# EAGLE design divider-top (EAGLE 7.7.0)
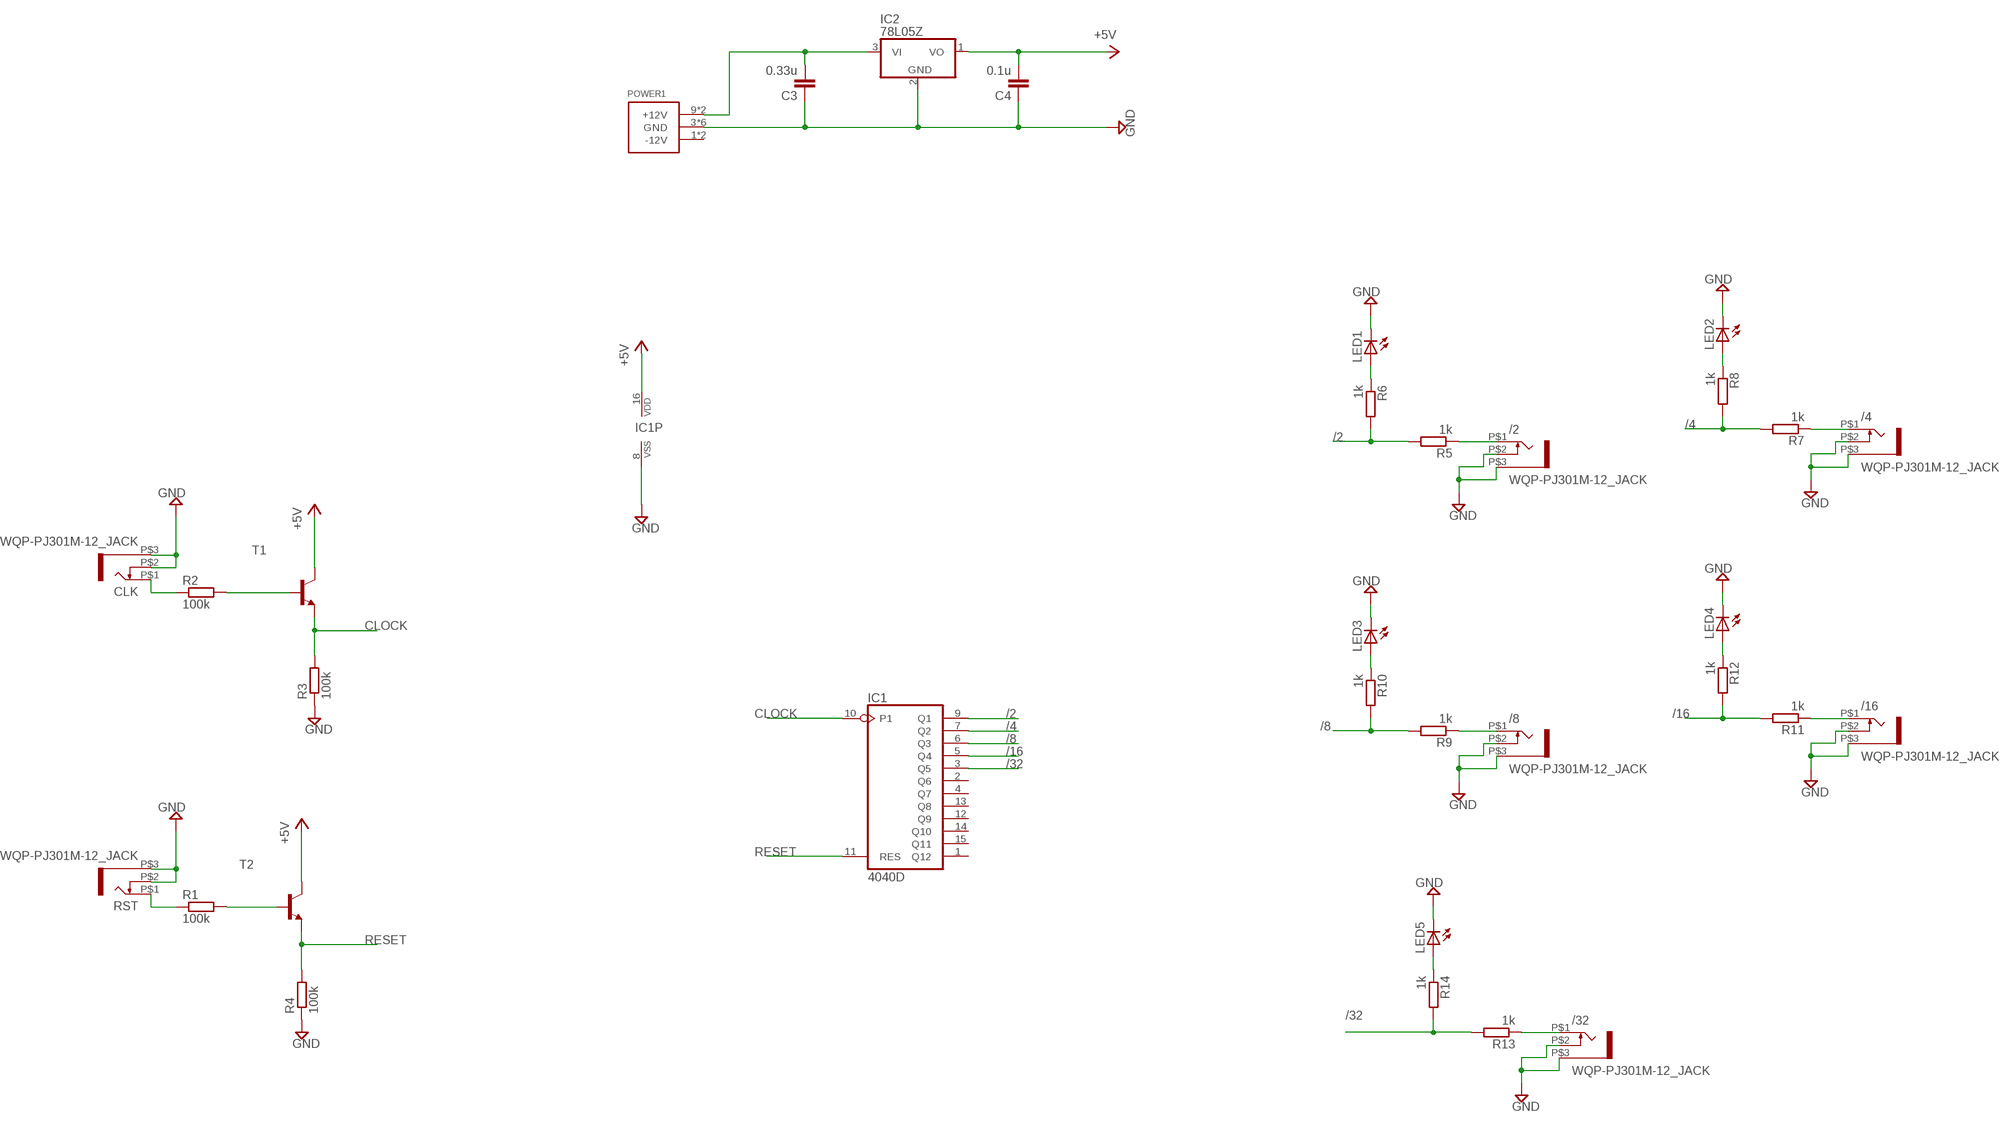
[diagram p0: schematic, sheet 1]

## Parts
/2  WQP-PJ301M-12_JACK  [WQP-PJ301M-12_JACK]
/4  WQP-PJ301M-12_JACK  [WQP-PJ301M-12_JACK]
/8  WQP-PJ301M-12_JACK  [WQP-PJ301M-12_JACK]
/16  WQP-PJ301M-12_JACK  [WQP-PJ301M-12_JACK]
/32  WQP-PJ301M-12_JACK  [WQP-PJ301M-12_JACK]
C3  0.33u  C-EUC0805  [C0805]
C4  0.1u  C-EUC0805  [C0805]
CLK  WQP-PJ301M-12_JACK  [WQP-PJ301M-12_JACK]
IC1  4040D  [SO16]
IC2  78L05Z  [TO92]
LED1  LEDCHIP-LED0805  [CHIP-LED0805]
LED2  LEDCHIP-LED0805  [CHIP-LED0805]
LED3  LEDCHIP-LED0805  [CHIP-LED0805]
LED4  LEDCHIP-LED0805  [CHIP-LED0805]
LED5  LEDCHIP-LED0805  [CHIP-LED0805]
POWER1  POWER_SIMPLE10  [POWER_10]
R1  100k  R-EU_R0805  [R0805]
R2  100k  R-EU_R0805  [R0805]
R3  100k  R-EU_R0805  [R0805]
R4  100k  R-EU_R0805  [R0805]
R5  1k  R-EU_R0805  [R0805]
R6  1k  R-EU_R0805  [R0805]
R7  1k  R-EU_R0805  [R0805]
R8  1k  R-EU_R0805  [R0805]
R9  1k  R-EU_R0805  [R0805]
R10  1k  R-EU_R0805  [R0805]
R11  1k  R-EU_R0805  [R0805]
R12  1k  R-EU_R0805  [R0805]
R13  1k  R-EU_R0805  [R0805]
R14  1k  R-EU_R0805  [R0805]
RST  WQP-PJ301M-12_JACK  [WQP-PJ301M-12_JACK]
T1  MMBT3904LT1-NPN-SOT23-BEC  [SOT23-BEC]
T2  MMBT3904LT1-NPN-SOT23-BEC  [SOT23-BEC]

## Nets
+5V: C4.2 IC1.16(VDD) IC2.1(VO) T1.C T2.C
/2: IC1.9(Q1) R5.2 R6.2
/4: IC1.7(Q2) R7.2 R8.2
/8: IC1.6(Q3) R9.2 R10.2
/16: IC1.5(Q4) R11.2 R12.2
/32: IC1.3(Q5) R13.2 R14.2
CLOCK: IC1.10(P1) R3.2 T1.E
GND: /2.P$2 /2.P$3 /4.P$2 /4.P$3 /8.P$2 /8.P$3 /16.P$2 /16.P$3 /32.P$2 /32.P$3 C3.1 C4.1 CLK.P$2 CLK.P$3 IC1.8(VSS) IC2.2(GND) LED1.C LED2.C LED3.C LED4.C LED5.C POWER1.3(GND) POWER1.4(GND) POWER1.5(GND) POWER1.6(GND) POWER1.7(GND) POWER1.8(GND) R3.1 R4.1 RST.P$2 RST.P$3
N$1: R1.1 RST.P$1
N$2: R1.2 T2.B
N$3: CLK.P$1 R2.1
N$4: /2.P$1 R5.1
N$5: R2.2 T1.B
N$6: /32.P$1 R13.1
N$7: LED1.A R6.1
N$8: LED5.A R14.1
N$9: /4.P$1 R7.1
N$10: LED2.A R8.1
N$12: /8.P$1 R9.1
N$13: LED3.A R10.1
N$15: /16.P$1 R11.1
N$16: LED4.A R12.1
N$21: C3.2 IC2.3(VI) POWER1.9(+12V) POWER1.10(+12V)
RESET: IC1.11(RES) R4.2 T2.E
Unconnected: IC1.1(Q12) IC1.2(Q6) IC1.4(Q7) IC1.12(Q9) IC1.13(Q8) IC1.14(Q10) IC1.15(Q11) POWER1.1(-12V) POWER1.2(-12V)

## Library data of the parts
/2 /4 /8 /16 /32 CLK RST = thonkiconn:WQP-PJ301M-12_JACK
C3 C4 = rcl:C-EU: CAPACITOR, European symbol
IC1 = 40xx:4040: 12-stage binary/ripple COUNTER
IC2 = linear:78*: Positive VOLTAGE REGULATOR Source: http://cache.national.com/ds/LM/LM78L05.pdf http://www.fairchildsemi.com/ds/LM/LM7805.pdf
LED1-LED5 = led:LED: LED OSRAM: - CHIPLED LG R971, LG N971, LY N971, LG Q971, LY Q971, LO R971, LY R971 LH N974, LH R974 LS Q976, LO Q976, LY Q976 LO Q996 - Hyper CHIPLED LW Q18S LB Q993, LB Q99A, LB R99A - SideLED LS A670, LO A670, LY A670, LG A670, LP A670 LB A673, LV A673, LT A673, LW A673 LH A674 LY A675 LS A676, LA A676, LO A676, LY A676, LW A676 LS A679, LY A679, LG A679 - Hyper Micro SIDELED® LS Y876, LA Y876, LO Y876, LY Y876 LT Y87S - SmartLED LW L88C, LW L88S LB L89C, LB L89S, LG L890 LS L89K, LO L89K, LY L89K LS L896, LA L896, LO L896, LY L896 - TOPLED LS T670, LO T670, LY T670, LG T670, LP T670 LSG T670, LSP T670, LSY T670, LOP T670, LYG T670 LG T671, LOG T671, LSG T671 LB T673, LV T673, LT T673, LW T673 LH T674 LS T676, LA T676, LO T676, LY T676, LB T676, LH T676, LSB T676, LW T676 LB T67C, LV T67C, LT T67C, LS T67K, LO T67K, LY T67K, LW E67C LS E67B, LA E67B, LO E67B, LY E67B, LB E67C, LV E67C, LT E67C LW T67C LS T679, LY T679, LG T679 LS T770, LO T770, LY T770, LG T770, LP T770 LB T773, LV T773, LT T773, LW T773 LH T774 LS E675, LA E675, LY E675, LS T675 LS T776, LA T776, LO T776, LY T776, LB T776 LHGB T686 LT T68C, LB T68C - Hyper Mini TOPLED® LB M676 - Mini TOPLED Santana® LG M470 LS M47K, LO M47K, LY M47K Source: http://www.osram.convergy.de LUXEON: - LUMILED® LXK2-PW12-R00, LXK2-PW12-S00, LXK2-PW14-U00, LXK2-PW14-V00 LXK2-PM12-R00, LXK2-PM12-S00, LXK2-PM14-U00 LXK2-PE12-Q00, LXK2-PE12-R00, LXK2-PE12-S00, LXK2-PE14-T00, LXK2-PE14-U00 LXK2-PB12-K00, LXK2-PB12-L00, LXK2-PB12-M00, LXK2-PB14-N00, LXK2-PB14-P00, LXK2-PB14-Q00 LXK2-PR12-L00, LXK2-PR12-M00, LXK2-PR14-Q00, LXK2-PR14-R00 LXK2-PD12-Q00, LXK2-PD12-R00, LXK2-PD12-S00 LXK2-PH12-R00, LXK2-PH12-S00 LXK2-PL12-P00, LXK2-PL12-Q00, LXK2-PL12-R00 Source: www.luxeon.com KINGBRIGHT: KA-3528ASYC Source: www.kingbright.com
POWER1 = eurorack:POWER_SIMPLE
R1-R14 = rcl:R-EU_: RESISTOR, European symbol
T1 T2 = transistor:*-NPN-: NPN Transistror BF959 corrected 2008.03.06

## Board
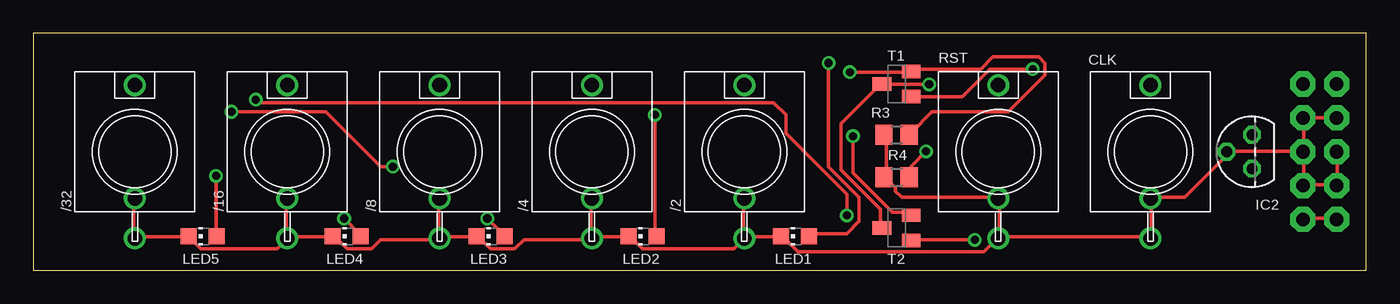
[diagram p1: board, top side]
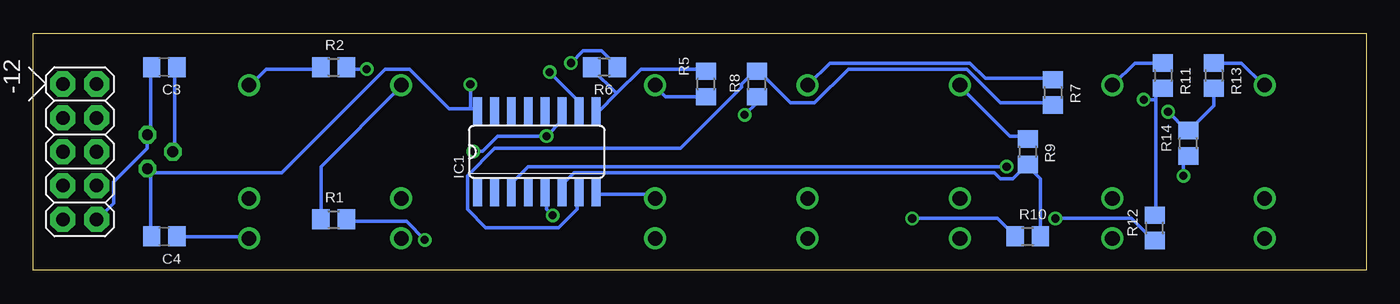
[diagram p2: board, bottom side, seen from below]

Size 100 x 17.77 mm. Coordinates in mm from the lower left corner, seen from the top.
Outline: 0,0 100,0 100,17.77 0,17.77 0,0
Copper layers (1*16): Top 0.035mm / dielectric 1.5mm / Bottom 0.035mm
Design rules "default": minimum track width 10mil, minimum drill 24mil, track to track 8mil, track to pad 8mil, pad to pad 8mil, via to via 8mil, smd to smd 8mil, copper to edge 40mil, drill to drill 8mil, minimum pad ring 10mil, minimum via ring 8mil, stop-mask expansion 4mil, vias tented up to drill 0mil, thermal gap 10mil

### Footprints (pad centres in the part's own frame; a part is rotated, then mirrored left to right if it is on the bottom)
WQP-PJ301M-12_JACK = drill 1.1: P$1 0,5; P$2 0,-3.5; P$3 0,-6.5
C0805 = smd 1.3 x 1.5: 1 -0.95,0; 2 0.95,0
SO16 = smd 0.66 x 2.032: 1 -4.445,-3.073; 2 -3.175,-3.073; 3 -1.905,-3.073; 4 -0.635,-3.073; 5 0.635,-3.073; 6 1.905,-3.073; 7 3.175,-3.073; 8 4.445,-3.073; 9 4.445,3.073; 10 3.175,3.073; 11 1.905,3.073; 12 0.635,3.073; 13 -0.635,3.073; 14 -1.905,3.073; 15 -3.175,3.073; 16 -4.445,3.073
TO92 = drill 0.813 octagon: 1 -1.27,0; 2 0,1.905; 3 1.27,0
CHIP-LED0805 = smd 1.2 x 1.2: A 0,-1.05; C 0,1.05
POWER_10 = drill 1.016 pad 1.88 octagon: 1 -5.08,-1.27; 2 -5.08,1.27; 3 -2.54,-1.27; 4 -2.54,1.27; 5 0,-1.27; 6 0,1.27; 7 2.54,-1.27; 8 2.54,1.27; 9 5.08,-1.27; 10 5.08,1.27
R0805 = smd 1.3 x 1.5: 1 -0.95,0; 2 0.95,0
SOT23-BEC = smd 1 x 1.4: B -0.95,-1.1; C 0,1.1; E 0.95,-1.1

### Placement (x,y rotation side)
/2  53.34,8.89 0 top
/4  41.91,8.89 0 top
/8  30.48,8.89 0 top
/16  19.05,8.89 0 top
/32  7.62,8.89 0 top
C3  90.17,15.24 180 bottom
C4  90.17,2.54 180 bottom
CLK  83.82,8.89 0 top
IC1  62.23,8.89 0 bottom
IC2  91.44,8.89 90 top
LED1  57.15,2.54 90 top
LED2  45.72,2.54 90 top
LED3  34.29,2.54 90 top
LED4  23.5,2.54 90 top
LED5  12.7,2.54 90 top
POWER1  96.52,8.89 270 bottom
R1  77.47,3.81 0 bottom
R2  77.47,15.24 0 bottom
R3  64.77,10.16 0 top
R4  64.77,6.99 0 top
R5  49.53,13.97 90 bottom
R6  57.15,15.24 180 bottom
R7  23.5,13.34 270 bottom
R8  45.72,13.97 90 bottom
R9  25.4,8.89 270 bottom
R10  25.4,2.54 0 bottom
R11  15.24,14.61 270 bottom
R12  15.88,3.17 90 bottom
R13  11.43,14.61 270 bottom
R14  13.34,9.53 90 bottom
RST  72.39,8.89 0 top
T1  64.77,13.97 90 top
T2  64.77,3.17 90 top

### Tracks (layer width: path | path; a pad name or v marks a point on that pad's centre or on a via)
+5V  (via drill 0.61)
  Top 0.254: T2.C 63.55,3.2 63.55,4.57 60.58,7.54 60.58,10.97 63.55,13.95 T1.C 63.78,13.95 v67.21,13.95
  Bottom 0.254: 91.21,7.32 91.21,2.74 C4.2 | 91.21,7.32 91.44,7.54 IC2.1 91.21,7.32 | 67.21,12.12 68.81,12.12 71.78,15.09 73.61,15.09 81.38,7.32 91.21,7.32 | 67.21,12.12 66.75,12.12 IC1.16 | 67.21,12.12 v67.21,13.95
/2
  Bottom 0.254: 56.24,13.26 57.61,11.89 IC1.9 | 56.24,13.26 54.41,15.09 49.61,15.09 R5.2 | 56.24,13.26 58.06,15.09 R6.2
/4
  Bottom 0.254: 45.72,15.09 43.2,12.57 41.38,12.57 38.86,15.09 29.95,15.09 27.43,12.57 23.55,12.57 R7.2 | 45.72,15.09 46.86,13.95 46.86,13.72 51.44,9.14 65.38,9.14 67.44,7.09 67.44,4.57 66.06,3.2 60.58,3.2 59.21,4.57 59.21,5.71 IC1.7 | 45.72,15.09 R8.2
/8
  Bottom 0.254: R10.2 24.46,2.74 24.46,6.86 25.38,7.77 R9.2 25.6,7.77 26.52,6.86 27.43,6.86 27.89,7.32 59.44,7.32 60.12,6.63 60.12,5.94 IC1.6
/16  (via drill 0.61)
  Top 0.254: v61.04,4.12 61.04,5.71 56.46,10.29 56.46,11.66 55.55,12.57 16.92,12.57 v16.69,12.8
  Bottom 0.254: 15.77,12.8 15.77,13.03 15.32,13.49 R11.2 | 15.77,12.8 15.77,4.34 R12.2 | v61.04,4.12 61.49,4.57 61.49,5.71 IC1.5 | 15.77,12.8 v16.69,12.8
/32  (via drill 0.61)
  Top 0.254: v26.98,7.77 26.06,7.77 21.95,11.89 v14.86,11.89
  Bottom 0.254: R13.2 11.43,12.34 13.26,10.52 R14.2 13.49,10.52 v14.86,11.89 | v26.98,7.77 62.87,7.77 64.01,6.63 64.01,5.94 IC1.3
CLOCK  (via drill 0.61)
  Top 0.254: R3.2 65.84,10.29 67.44,11.89 73.15,11.89 75.89,14.63 75.89,15.54 75.44,16 72.01,16 71.09,15.09 66.06,15.09 T1.E 65.84,14.86 v61.27,14.86
  Bottom 0.254: v61.27,14.86 59.21,12.8 59.21,12.12 IC1.10
GND
  Top 0.254: R3.1 64.01,10.06 64.01,7.09 R4.1 64.01,6.86 64.69,6.17 64.69,5.94 65.15,5.49 72.24,5.49 RST.P$2 72.47,5.26 72.47,2.52 | POWER1.3 95.33,11.43 | POWER1.5 97.84,8.69 97.84,6.4 POWER1.7 97.61,6.4 95.33,6.4 | 95.33,6.4 95.33,8.69 POWER1.6 | POWER1.6 95.1,8.91 89.61,8.91 IC2.2 89.61,8.69 86.41,5.49 83.9,5.49 CLK.P$2 83.9,5.26 83.9,2.52 CLK.P$3 83.67,2.52 72.47,2.52 | 95.33,6.4 POWER1.8 | 95.33,11.43 95.33,8.91 POWER1.6 | 95.33,11.43 POWER1.4 | 72.47,2.52 RST.P$3 72.24,2.29 71.32,1.37 57.38,1.37 56.24,2.52 LED1.C 56.01,2.52 53.49,2.52 /2.P$3 | /4.P$3 42.06,2.52 44.58,2.52 LED2.C 44.81,2.52 45.72,1.6 52.58,1.6 53.26,2.29 /2.P$3 | /4.P$2 41.83,5.26 41.83,2.52 /4.P$3 | /2.P$3 53.26,2.52 53.26,5.26 /2.P$2 | /32.P$2 7.54,5.26 7.54,2.52 /32.P$3 7.77,2.52 11.43,2.52 LED5.C 11.66,2.52 12.57,1.6 18.29,1.6 18.97,2.29 /16.P$3 | /8.P$3 30.63,2.52 33.15,2.52 LED3.C 33.38,2.52 34.29,1.6 36.12,1.6 36.8,2.29 41.83,2.29 /4.P$3 | /8.P$2 30.4,5.26 30.4,2.52 /8.P$3 | /16.P$3 19.2,2.52 22.4,2.52 LED4.C 22.63,2.52 23.55,1.6 25.38,1.6 26.06,2.29 30.4,2.29 /8.P$3 | /16.P$2 18.97,5.26 18.97,2.52 /16.P$3
  Bottom 0.254: C4.1 89.15,2.52 83.9,2.52 CLK.P$3 | C3.1 89.38,15.09 89.38,8.91 IC2.2 | IC1.8 57.61,5.71 53.72,5.71 53.49,5.49 /2.P$2
N$1
  Bottom 0.254: R1.1 78.41,3.89 78.41,7.77 72.47,13.72 RST.P$1
N$2  (via drill 0.61)
  Top 0.254: v70.64,2.29 66.06,2.29 T2.B
  Bottom 0.254: v70.64,2.29 72.01,3.66 76.35,3.66 R1.2
N$3
  Bottom 0.254: R2.1 78.64,15.09 82.53,15.09 83.67,13.95 CLK.P$1
N$4
  Bottom 0.254: R5.1 49.61,13.03 52.58,13.03 53.26,13.72 /2.P$1
N$5  (via drill 0.61)
  Top 0.254: v74.98,15.09 71.78,15.09 69.72,13.03 66.06,13.03 T1.B
  Bottom 0.254: v74.98,15.09 76.35,15.09 R2.2
N$6
  Bottom 0.254: R13.1 9.37,15.54 7.77,13.95 /32.P$1
N$7  (via drill 0.61)
  Top 0.254: v59.66,15.54 59.66,7.77 61.95,5.49 61.95,3.66 61.04,2.74 58.29,2.74 LED1.A
  Bottom 0.254: v59.66,15.54 58.75,16.46 57.38,16.46 56.24,15.32 R6.1
N$8  (via drill 0.61)
  Top 0.254: v13.72,7.09 13.72,2.74 LED5.A
  Bottom 0.254: v13.72,7.09 13.72,8.23 13.49,8.46 R14.1
N$9
  Bottom 0.254: R7.1 23.55,14.4 28.57,14.4 29.72,15.54 40.23,15.54 41.83,13.95 /4.P$1
N$10  (via drill 0.61)
  Top 0.254: v46.63,11.66 46.63,2.74 LED2.A
  Bottom 0.254: v46.63,11.66 45.72,12.57 R8.1
N$12
  Bottom 0.254: R9.1 25.6,10.06 26.75,10.06 30.4,13.72 /8.P$1
N$13  (via drill 0.61)
  Top 0.254: v34.06,3.89 35.2,2.74 LED3.A
  Bottom 0.254: v34.06,3.89 27.66,3.89 26.52,2.74 R10.1
N$15
  Bottom 0.254: R11.1 15.32,15.54 17.37,15.54 18.97,13.95 /16.P$1
N$16  (via drill 0.61)
  Top 0.254: v23.32,3.89 24.46,2.74 LED4.A
  Bottom 0.254: v23.32,3.89 17.6,3.89 16,2.29 R12.1
N$21
  Top 0.254: POWER1.10 95.33,3.89 97.61,3.89 POWER1.9
  Bottom 0.254: C3.2 91.21,15.09 91.21,10.52 91.44,10.29 IC2.3 91.44,9.14 93.95,6.63 93.95,5.03 95.1,3.89 POWER1.10
RESET  (via drill 0.61)
  Top 0.254: v61.49,10.06 61.49,7.32 64.47,4.34 65.84,4.34 T2.E | v66.98,8.91 65.84,7.77 65.84,7.09 R4.2
  Bottom 0.254: IC1.11 60.35,11.89 60.35,11.2 v61.49,10.06 65.15,10.06 66.29,8.91 v66.98,8.91